# Altium schematic sheet STWD100+CD4060BM_定时器复位.SchDoc
size A4
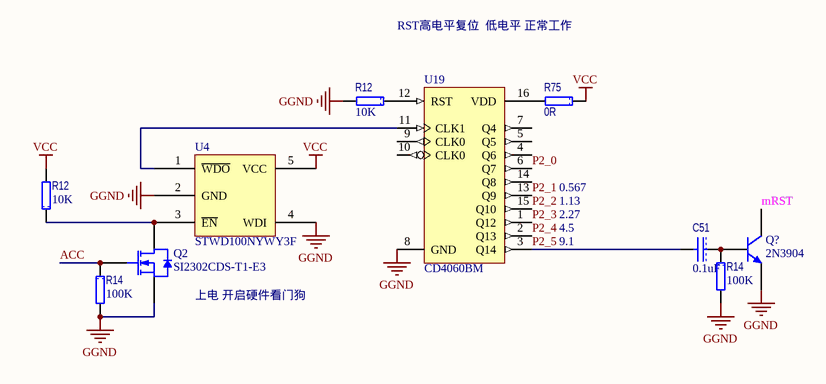
[diagram p0: STWD100+CD4060BM_定时器复位.SchDoc]

## Parts
(Parts that share a designator on the sheet are numbered #1, #2 ... from top to bottom, then left to right.)
C51  value 0.1uF  [1608[0603]C]  (hidden comment: C1608X7R1H104K)
Q2  SI2302CDS-T1-E3  [SOT23_N]
Q?  2N3904  [TO-92A]
R12#1  value 10K  [1608[0603]R]  (hidden comment: CRCW060310K0FKEA)
R12#2  value 10K  [1608[0603]R]  (hidden comment: CRCW060310K0FKEA)
R14#1  value 100K  [1608[0603]R]  (hidden comment: CRCW0603100KFKEA)
R14#2  value 100K  [1608[0603]R]  (hidden comment: CRCW0603100KFKEA)
R75  0R  [0603R]
U4  STWD100NYWY3F  [SOT23-5BN]
U19  CD4060BM  [M16A_N]

## Nets
GGND: Q2.2(S) Q?.1(E) R12#1.2 R14#1.2 R14#2.2 U4.2(GND) U4.4(WDI) U19.8(GND)
VCC: R12#2.2 R75.1 U4.5(VCC)
ACC: Q2.1(G) R14#2.1
mRST: Q?.3(C)
P2_0: U19.6(Q7)
P2_1: U19.13(Q9)
P2_2: U19.15(Q10)
P2_3: U19.1(Q12)
P2_4: U19.2(Q13)
P2_5: C51.2 U19.3(Q14)
NetC51_1: C51.1 Q?.2(B) R14#1.1
NetQ2_3: Q2.3(D) R12#2.1 U4.3(~{EN})
NetR12#1_1: R12#1.1 U19.12(RST)
NetR75_2: R75.2 U19.16(VDD)
NetU4_1: U4.1(~{WDO}) U19.11(CLK1)

Not connected (* = marked no-connect by the designer): U19 4(Q6) 5(Q5) 7(Q4) 9(CLK0) 10(CLK0) 14(Q8)

## Notes on the sheet
- RST高电平复位  低电平 正常工作
- 2.27
- 1.13
- 0.567
- 9.1
- 4.5
- 上电 开启硬件看门狗

## Library data of the parts
C51 = CAP: 多层陶瓷电容器MLCC - SMD/SMT 0603 0.1uF 50volts X7R 10%; Manufacturer: TDK; 产品: General Type MLCCs; 产品种类: Low & Medium Capacitance SMD Ceramic Chip Capacitors; 外壳代码 - in: 0603; 外壳代码 - mm: 1608; 封装 / 箱体: 0603 (1608 metric); 封装: Reel; 尺寸: 0.8 mm W x 1.6 mm L x 0.8 mm H; 工作温度范围: - 55 C to + 125 C; 标准包装数量: 4000; 电压额定值: 50 V; 电容-nF: 100 nF; 电容-pF: 100000 pF; 系列: C; Category: 多层陶瓷电容器MLCC - SMD/SMT; ComponentLink1Description: http://www.tdk.com/pdf/general_B11.pdf; ComponentLink1URL: http://www.tdk.com/pdf/general_B11.pdf; Description 1: 多层陶瓷电容器MLCC - SMD/SMT 0603 0.1uF 50volts X7R 10%; Manufacturer Part Number: C1608X7R1H104K; Minimum Order Quantity: 1; Pricing 1: 1=0.160, 50=0.070, 100=0.036, 500=0.019, 1000=0.013, 4000=0.010, 8000=0.009, 12000=0.008, 20000=0.007 (USD); Reeling: True; RoHS - 贸泽: Y; RoHS: RoHS Compliant; Stock 1: 224604; Supplier 1: Mouser; Supplier Part Number 1: 810-C1608X7R1H104K; 制造商: TDK; 容差: 10 %; 温度系数/代码: X7R; 电容: 0.1 uF; 端接类型: SMD/SMT
Q2 = 2N7002: MOSFET 20V 2.9A 0.86W 57mohm @ 4.5V; Manufacturer: Vishay / Siliconix; 配置: Single; 封装 / 箱体: SOT-23-3; 封装: Reel; 漏极连续电流: 2.6 A; 闸/源击穿电压: +/- 8 V; 安装风格: SMD/SMT; 功率耗散: 710 mW; 电阻汲极/源极 RDS（导通）: 0.057 Ohms; 晶体管极性: N-Channel; 下降时间: 7 ns; 制造商: Vishay; 最大工作温度: + 150 C; 最小工作温度: - 55 C; 产品种类: N-Channel MOSFETs; 标准包装数量: 3000; 典型关闭延迟时间: 30 ns; Supplier 1: Mouser; Supplier Part Number 1: 781-SI2302CDS-E3; Manufacturer Part Number: SI2302CDS-T1-E3; RoHS: RoHS Compliant; Description 1: MOSFET 20V 2.9A 0.86W 57mohm @ 4.5V; Category: MOSFET; Stock 1: 51301; Pricing 1: 1=0.150, 10=0.140, 100=0.130, 250=0.125, 500=0.120, 1000=0.115, 3000=0.110, 6000=0.105, 12000=0.100 (USD); 汲极/源极击穿电压: 20 V; 上升时间: 7 ns; RoHS - 贸泽: Y; Minimum Order Quantity: 1; Reeling: True; ComponentLink1URL: http://www.vishay.com/doc?68645; ComponentLink1Description: http://www.vishay.com/doc?68645
Q? = 2N3904: NPN General Purpose Amplifier; Published: 8-Jun-2000; LatestRevisionDate: 15-Jan-2003; LatestRevisionNote: PCB Footprint 'BCY-W3/D4.7' replaced; DatasheetVersion: 1997; PackageVersion: Sep-1998; PackageReference: TO-92A; Publisher: Altium Limited; PackageDescription: TO, Flat Index; 3 In-Line, Axial Leads; Body Dia. 4.5mm; Leads 0.51 x 0.48 mm (max); ComponentLink1Description: Manufacturer Link; ComponentLink1URL: http://www.fairchildsemi.com/; ComponentLink2Description: Datasheet; ComponentLink2URL: http://www.fairchildsemi.com/ds/2N%2F2N3904.pdf
R12#1 R12#2 = RES: 厚膜电阻器 - SMD 1/10watt 10Kohms 1%; Manufacturer: Vishay / Dale; 尺寸: 0.85 mm W x 1.55 mm L x 0.45 mm H; 工作温度范围: - 55 C to + 155 C; 封装 / 箱体: 0603 (1608 metric); 封装: Reel; 功率额定值: 100 mW; 产品: Thick Film Resistors SMD; 系列: CRCW; 温度系数: 100 PPM / K; 端接类型: SMD/SMT; 电压额定值: 75 V; 制造商: Vishay; 产品种类: 0603 Thick Film Chip Resistors; 标准包装数量: 5000; 外壳代码 - in: 0603; 外壳代码 - mm: 1608; Supplier 1: Mouser; Supplier Part Number 1: 71-CRCW0603-10K-E3; Manufacturer Part Number: CRCW060310K0FKEA; RoHS: RoHS Compliant By Exemption; Category: 厚膜电阻器 - SMD; Stock 1: 0; Pricing 1: 1=0.080, 10=0.013, 100=0.010, 1000=0.008, 5000=0.005, 25000=0.004, 50000=0.003 (USD); 电阻: 10 kOhms; 容差: 1 %; RoHS - 贸泽: E; Minimum Order Quantity: 1; Reeling: True; ComponentLink1URL: http://www.mouser.com/ds/2/427/dcrcwe3-109170.pdf; ComponentLink1Description: http://www.mouser.com/ds/2/427/dcrcwe3-109170.pdf; Description 1: 厚膜电阻器 - SMD 1/10watt 10Kohms 1%
R14#1 R14#2 = RES: 厚膜电阻器 - SMD 1/10watt 100Kohms 1%; Manufacturer: Vishay / Dale; 尺寸: 0.85 mm W x 1.55 mm L x 0.45 mm H; 工作温度范围: - 55 C to + 155 C; 封装 / 箱体: 0603 (1608 metric); 封装: Reel; 功率额定值: 100 mW; 产品: Thick Film Resistors SMD; 系列: CRCW; 温度系数: 100 PPM / K; 端接类型: SMD/SMT; 电压额定值: 75 V; 制造商: Vishay; 产品种类: 0603 Thick Film Chip Resistors; 标准包装数量: 5000; 外壳代码 - in: 0603; 外壳代码 - mm: 1608; Supplier 1: Mouser; Supplier Part Number 1: 71-CRCW0603-100K-E3; Manufacturer Part Number: CRCW0603100KFKEA; RoHS: RoHS Compliant By Exemption; Category: 厚膜电阻器 - SMD; Stock 1: 175756; Pricing 1: 1=0.080, 10=0.013, 100=0.010, 1000=0.008, 5000=0.005, 25000=0.004, 50000=0.003 (USD); 电阻: 100 kOhms; 容差: 1 %; RoHS - 贸泽: E; Minimum Order Quantity: 1; Reeling: True; ComponentLink1URL: http://www.mouser.com/ds/2/427/dcrcwe3-109170.pdf; ComponentLink1Description: http://www.mouser.com/ds/2/427/dcrcwe3-109170.pdf; Description 1: 厚膜电阻器 - SMD 1/10watt 100Kohms 1%
R75 = RES: Model: RT0603DRD7D0RL; 公司: vishay; Parameters: 50V 1/10W 0.5%; Type: 无铅电阻; Value: 0R
U4 = STWD100: 计时器和支持产品 Watchdog timer Supervisor Circuit; Manufacturer: STMicroelectronics; 封装 / 箱体: SOT-23-5; 封装: Reel; 安装风格: SMD/SMT; 最大工作温度: + 125 C; 最大功率耗散: 320 mW; 最小工作温度: - 40 C; 产品种类: Timers; 电源电压-最大: 5.5 V; 电源电压-最小: 2.7 V; Supplier 1: Mouser; Supplier Part Number 1: 511-STWD100NYWY3F; Manufacturer Part Number: STWD100NYWY3F; RoHS: RoHS Compliant; Description 1: 计时器和支持产品 Watchdog timer Supervisor Circuit; Category: 计时器和支持产品; Stock 1: 37877; Pricing 1: 1=0.930, 10=0.740, 100=0.720, 250=0.670, 500=0.570, 1000=0.506, 3000=0.450, 6000=0.419, 12000=0.410 (USD); 制造商: STMicroelectronics; RoHS - 贸泽: Y; Minimum Order Quantity: 1; Reeling: True; ComponentLink1URL: http://www.st.com/web/en/resource/technical/document/datasheet/CD00176077.pdf; ComponentLink1Description: http://www.st.com/web/en/resource/technical/document/datasheet/CD00176077.pdf
U19 = CD4060BCM: 14-Stage Ripple Carry Binary Counter; Published: 17-Jul-2002; LatestRevisionDate: 13-Apr-2006; LatestRevisionNote: IPC-7351 Footprint Added.; DatasheetVersion: Jan-1999; PackageVersion: 2000; PackageReference: M16A; Publisher: Altium Limited; PackageDescription: 16-Pin Small Outline Integrated Circuit 1.27 mm Pitch; Code_IPC: SOIC127P600-16; ComponentLink1Description: Manufacturer Link; ComponentLink1URL: http://www.fairchildsemi.com/; ComponentLink2Description: Datasheet; ComponentLink2URL: http://www.fairchildsemi.com/ds/CD%2FCD4040BC.pdf